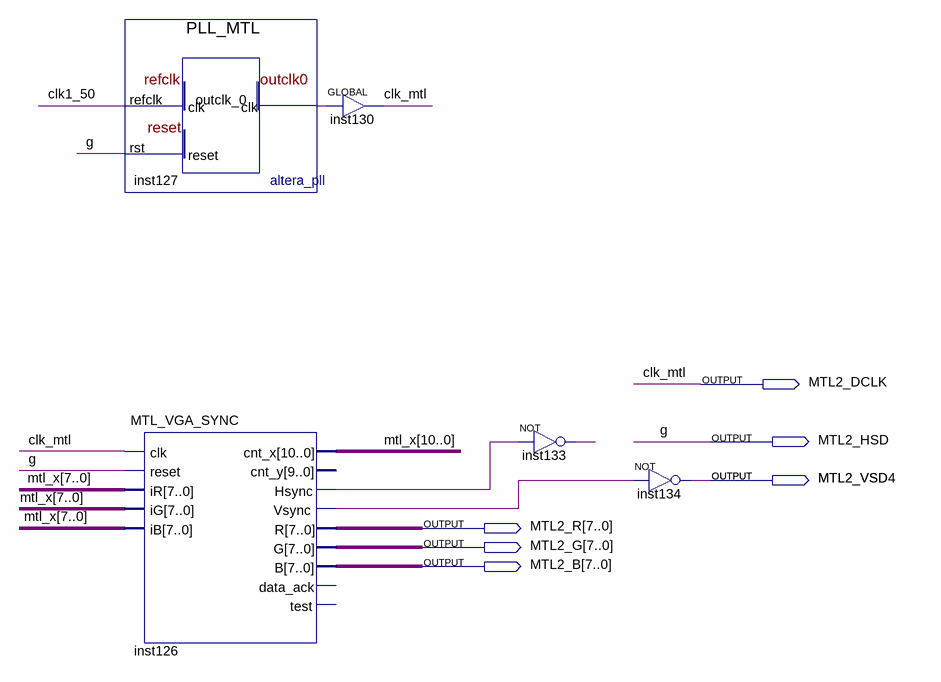
[diagram p0: schematic sheet]
// Quartus schematic MTL.bdf as structural Verilog: 5 symbols, 7 pins
module MTL (
  output MTL2_DCLK,
  output MTL2_HSD,
  output MTL2_VSD,
  output MTL2_VSD4,
  output [7:0] MTL2_R,
  output [7:0] MTL2_G,
  output [7:0] MTL2_B
);

  wire clk1_50, inst126_hsync, inst126_vsync, inst127_outclk_0, inst133_out;
  wire [10:0] mtl_x;

  PLL_MTL inst127 (.refclk(clk1_50), .rst(MTL2_HSD), .outclk_0(inst127_outclk_0));
  MTL_VGA_SYNC inst126 (
    .clk(MTL2_DCLK), .reset(MTL2_HSD), .iR(mtl_x[7:0]), .iG(mtl_x[7:0]), .iB(mtl_x[7:0]), .cnt_x(mtl_x),
    .Hsync(inst126_hsync), .Vsync(inst126_vsync), .R(MTL2_R), .G(MTL2_G), .B(MTL2_B));  // open: cnt_y, data_ack, test
  GLOBAL inst130 (.IN(inst127_outclk_0), .OUT(MTL2_DCLK));
  not inst133 (inst133_out, inst126_hsync);
  not inst134 (MTL2_VSD, inst126_vsync);

  assign MTL2_VSD4 = MTL2_VSD;

  // Other names for the same wires on the sheet: clk_mtl = MTL2_DCLK; g = MTL2_HSD
endmodule
